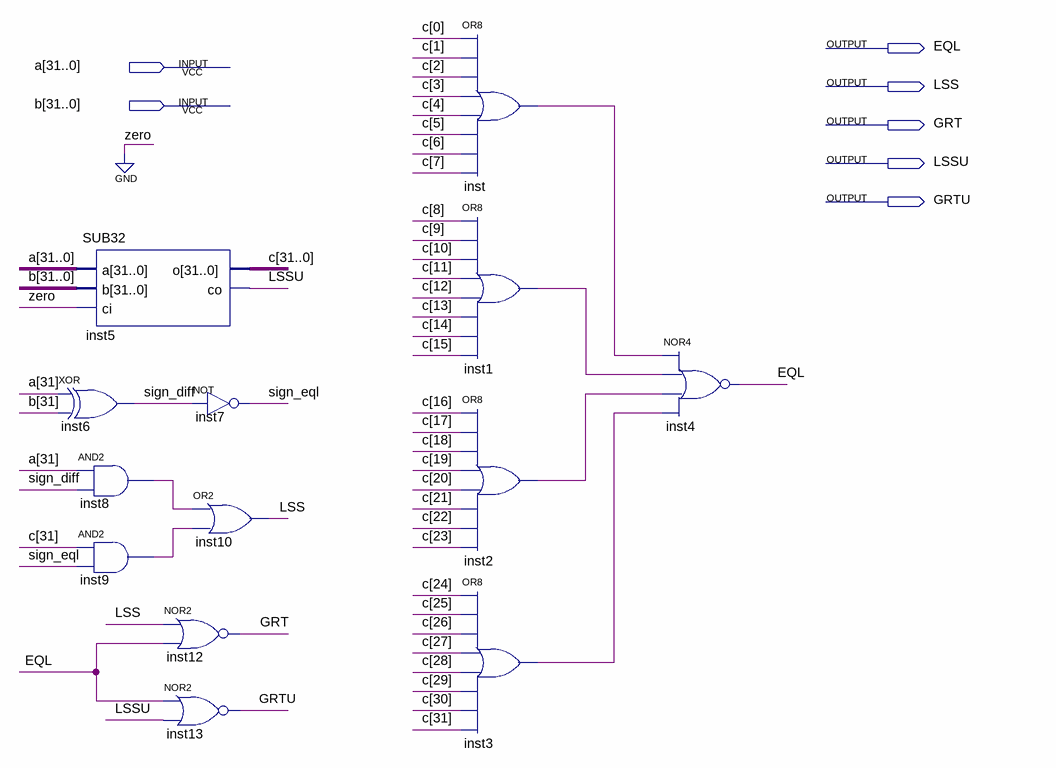
[diagram p0: schematic sheet]
// Quartus schematic CMP32.bdf as structural Verilog: 13 symbols, 7 pins
module CMP32 (
  input  [31:0] a,
  input  [31:0] b,
  output EQL,
  output LSS,
  output GRT,
  output LSSU,
  output GRTU
);

  wire inst1_out, inst2_out, inst3_out, inst8_out, inst9_out, inst_out, sign_diff, sign_eql;
  wire [31:0] c;

  SUB32 inst5 (.a(a), .b(b), .ci(1'b0), .o(c), .co(LSSU));
  xor inst6 (sign_diff, a[31], b[31]);
  and inst8 (inst8_out, a[31], sign_diff);
  and inst9 (inst9_out, c[31], sign_eql);
  nor inst12 (GRT, LSS, EQL);
  nor inst13 (GRTU, EQL, LSSU);
  not inst7 (sign_eql, sign_diff);
  or inst10 (LSS, inst8_out, inst9_out);
  or inst (inst_out, c[0], c[1], c[2], c[3], c[4], c[5], c[6], c[7]);
  or inst1 (inst1_out, c[8], c[9], c[10], c[11], c[12], c[13], c[14], c[15]);
  or inst2 (inst2_out, c[16], c[17], c[18], c[19], c[20], c[21], c[22], c[23]);
  or inst3 (inst3_out, c[24], c[25], c[26], c[27], c[28], c[29], c[30], c[31]);
  nor inst4 (EQL, inst_out, inst1_out, inst2_out, inst3_out);
endmodule
